# EAGLE design dani_pcb (EAGLE 9.3.2)
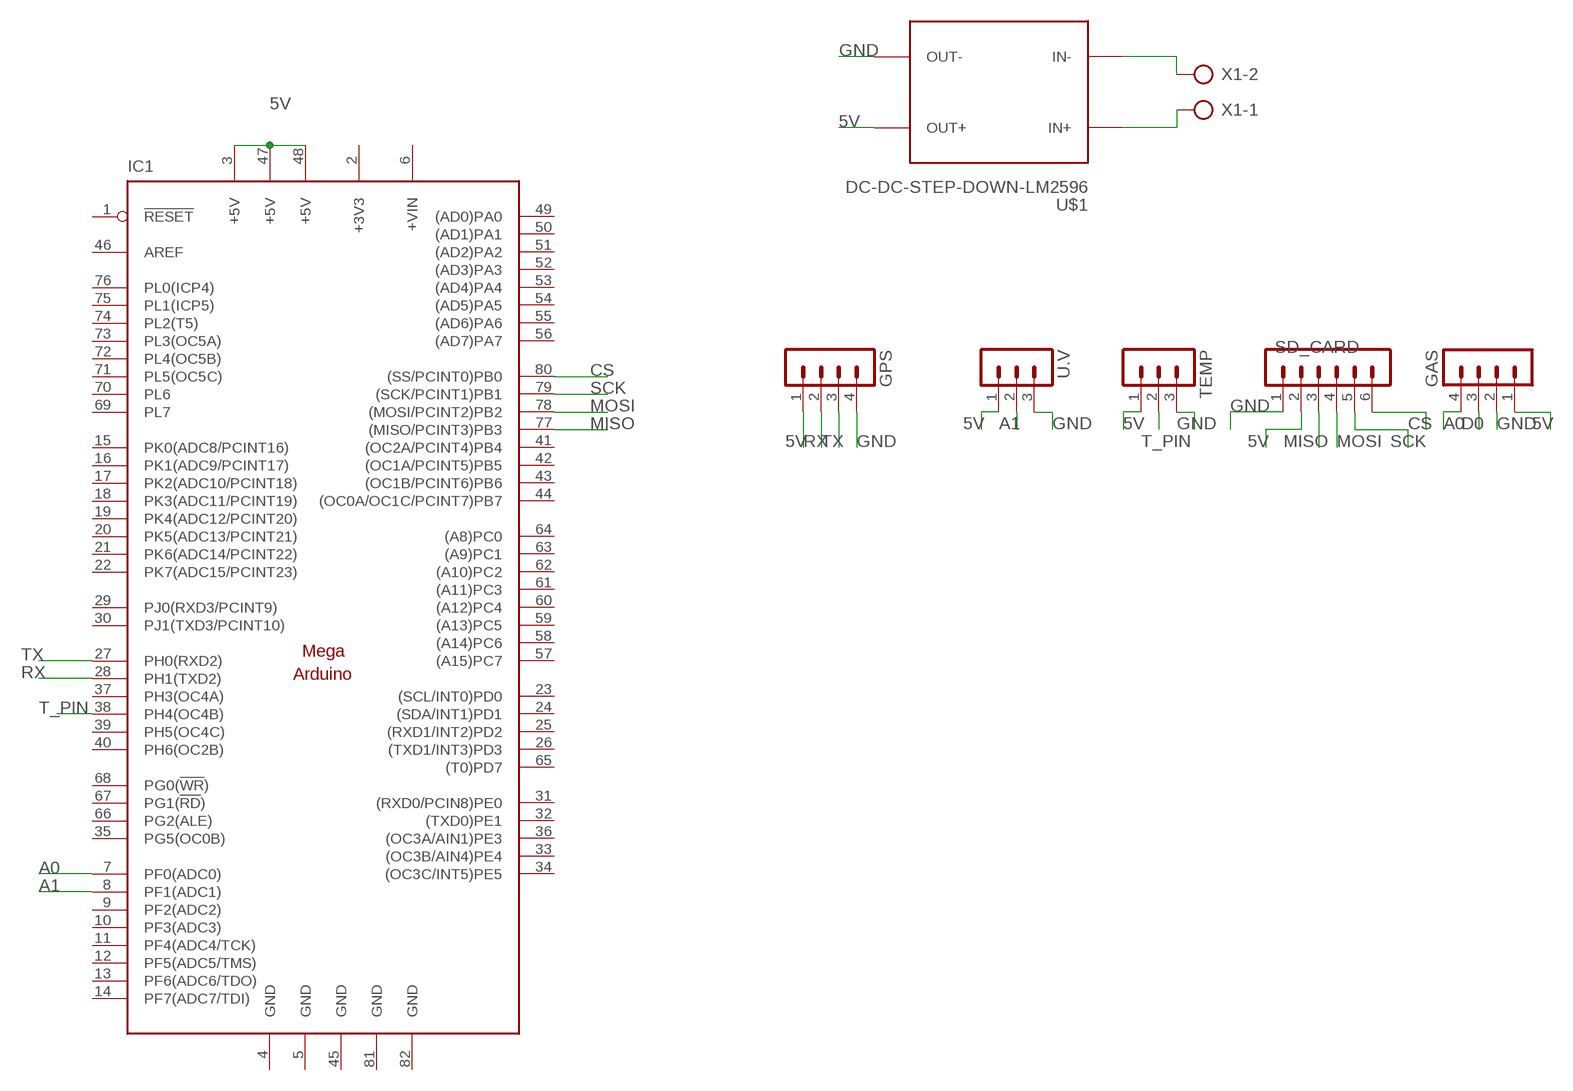
[diagram p0: schematic, sheet 1]

## Parts
GAS  MA04-1  [MA04-1]
GPS  MA04-1  [MA04-1]
IC1  MEGAARDUINO_1  [MEGA_ARDUINO]
SD_CARD  MA06-1  [MA06-1]
TEMP  MA03-1  [MA03-1]
U$1  DC-DC-STEP-DOWN-LM2596  [DC-DC-STEP-DOWN-LM2596]
U.V  MA03-1  [MA03-1]
X1  AK500/2-H  [AK500/2-H]

## Nets
5V: GAS.1 GPS.1 IC1.3(+5V) IC1.47(+5V) IC1.48(+5V) SD_CARD.2 TEMP.1 U$1.OUT+ U.V.1
A0: GAS.4 IC1.7(PF0(ADC0))
A1: IC1.8(PF1(ADC1)) U.V.2
CS: IC1.80((SS/PCINT0)PB0) SD_CARD.6
D0: GAS.3
GND: GAS.2 GPS.4 SD_CARD.1 TEMP.3 U$1.OUT- U.V.3
MISO: IC1.77((MISO/PCINT3)PB3) SD_CARD.3
MOSI: IC1.78((MOSI/PCINT2)PB2) SD_CARD.4
N$1: U$1.IN- X1.2
N$2: U$1.IN+ X1.1
RX: GPS.2 IC1.28(PH1(TXD2))
SCK: IC1.79((SCK/PCINT1)PB1) SD_CARD.5
T_PIN: IC1.38(PH4(OC4B)) TEMP.2
TX: GPS.3 IC1.27(PH0(RXD2))
Unconnected: IC1.1(!RESET) IC1.9(PF2(ADC2)) IC1.10(PF3(ADC3)) IC1.11(PF4(ADC4/TCK)) IC1.12(PF5(ADC5/TMS)) IC1.13(PF6(ADC6/TDO)) IC1.14(PF7(ADC7/TDI)) IC1.15(PK0(ADC8/PCINT16)) IC1.16(PK1(ADC9/PCINT17)) IC1.17(PK2(ADC10/PCINT18)) IC1.18(PK3(ADC11/PCINT19)) IC1.19(PK4(ADC12/PCINT20)) IC1.20(PK5(ADC13/PCINT21)) IC1.21(PK6(ADC14/PCINT22)) IC1.22(PK7(ADC15/PCINT23)) IC1.23((SCL/INT0)PD0) IC1.24((SDA/INT1)PD1) IC1.25((RXD1/INT2)PD2) IC1.26((TXD1/INT3)PD3) IC1.29(PJ0(RXD3/PCINT9)) IC1.30(PJ1(TXD3/PCINT10)) IC1.31((RXD0/PCIN8)PE0) IC1.32((TXD0)PE1) IC1.33((OC3B/AIN4)PE4) IC1.34((OC3C/INT5)PE5) IC1.35(PG5(OC0B)) IC1.36((OC3A/AIN1)PE3) IC1.37(PH3(OC4A)) IC1.39(PH5(OC4C)) IC1.40(PH6(OC2B)) IC1.41((OC2A/PCINT4)PB4) IC1.42((OC1A/PCINT5)PB5) IC1.43((OC1B/PCINT6)PB6) IC1.44((OC0A/OC1C/PCINT7)PB7) IC1.46(AREF) IC1.49((AD0)PA0) IC1.50((AD1)PA1) IC1.51((AD2)PA2) IC1.52((AD3)PA3) IC1.53((AD4)PA4) IC1.54((AD5)PA5) IC1.55((AD6)PA6) IC1.56((AD7)PA7) IC1.57((A15)PC7) IC1.58((A14)PC6) IC1.59((A13)PC5) IC1.60((A12)PC4) IC1.61((A11)PC3) IC1.62((A10)PC2) IC1.63((A9)PC1) IC1.64((A8)PC0) IC1.65((T0)PD7) IC1.66(PG2(ALE)) IC1.67(PG1(!RD!)) IC1.68(PG0(!WR!)) IC1.69(PL7) IC1.70(PL6) IC1.71(PL5(OC5C)) IC1.72(PL4(OC5B)) IC1.73(PL3(OC5A)) IC1.74(PL2(T5)) IC1.75(PL1(ICP5)) IC1.76(PL0(ICP4))

## Power pins joined to a net without a drawn wire
+3V3: IC1.2(+3V3)
+VIN: IC1.6(+VIN)
GND: IC1.4(GND) IC1.5(GND) IC1.45(GND) IC1.81(GND) IC1.82(GND)

## Library data of the parts
GAS GPS = con-lstb:MA04-1: PIN HEADER; OC_FARNELL: unknown; OC_NEWARK: unknown
IC1 = arduino:MEGAARDUINO_1: The Arduino Mega is a microcontroller board based on the ATmega1280. - 54 digital input/output pins (of which 14 can be used as PWM outputs) - 16 analog inputs - 4 UARTs (hardware serial ports) - 16 MHz crystal oscillator - USB connection - power jack - ICSP header - reset button It contains everything needed to support the microcontroller; simply connect it to a computer with a USB cable or power it with a AC-to-DC adapter or battery to get started. The Mega is compatible with most shields designed for the Arduino Duemilanove or Diecimila. http://arduino.cc/en/Main/ArduinoBoardMega
SD_CARD = con-lstb:MA06-1: PIN HEADER; OC_FARNELL: unknown; OC_NEWARK: unknown
TEMP U.V = con-lstb:MA03-1: PIN HEADER; OC_FARNELL: unknown; OC_NEWARK: unknown
U$1 = diy_modules:DC-DC-STEP-DOWN-LM2596: DC/DC Step-Down Regulator based on LM2596-ADJ chip LM2596 datasheet available here: http://www.ti.com/lit/ds/symlink/lm2596.pdf Click here to find device on ebay.com <http://www.ebay.com/sch/lm2596+power+regulator>
X1 = con-ptr500:AK500/2-H: CONNECTOR Aug. 2004 / PTR Meßtechnik: Die Bezeichnung der Serie AK505 wurde geändert. Es handelt sich hierbei um AK500 in horizontaler Ausführung.; OC_FARNELL: unknown; OC_NEWARK: unknown

## Board
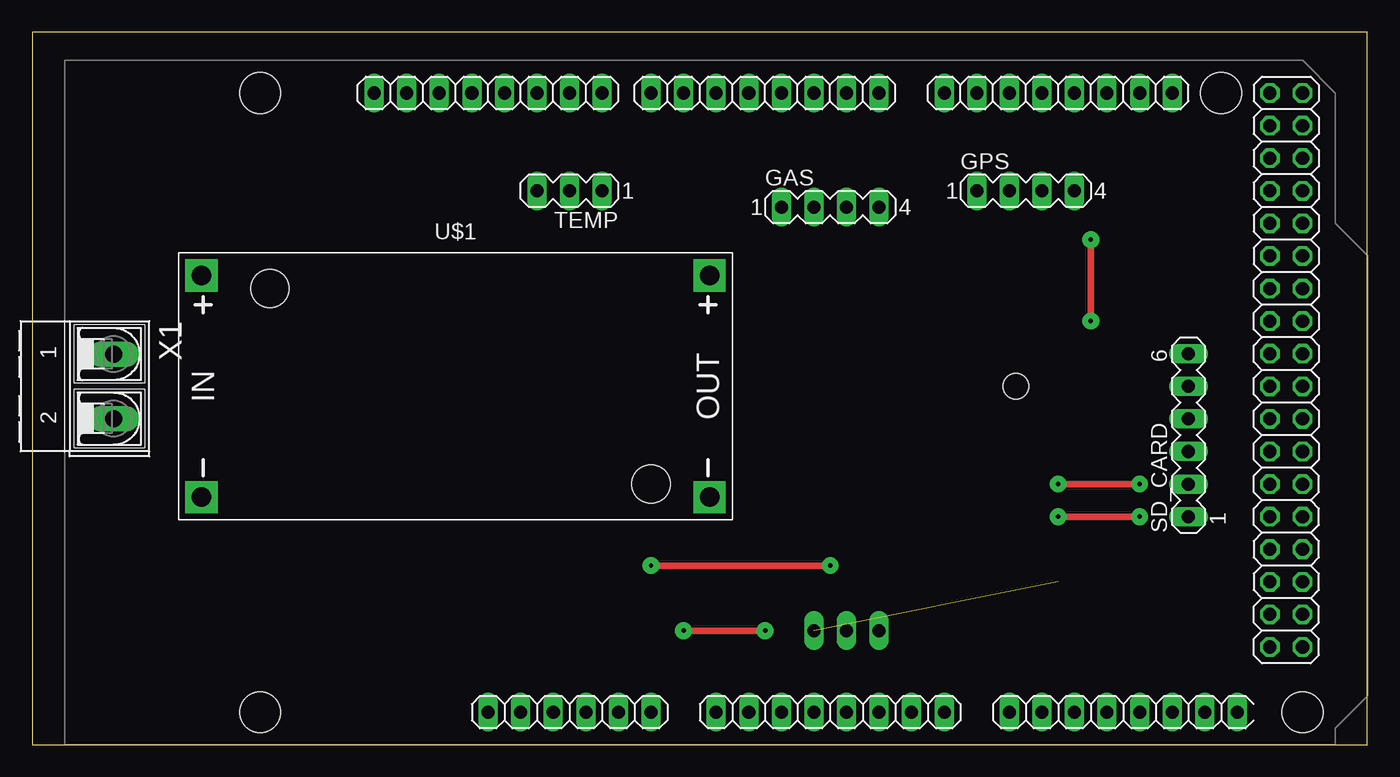
[diagram p1: board, top side]
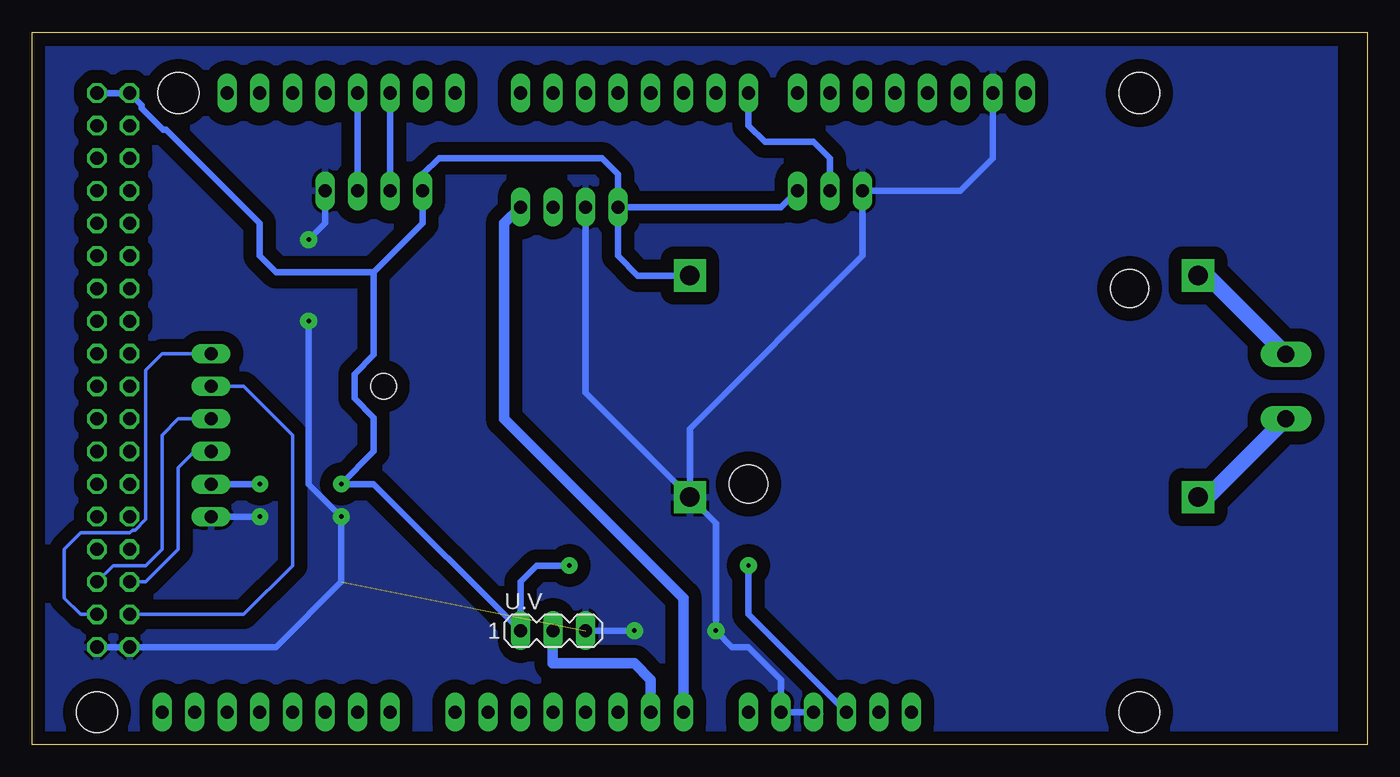
[diagram p2: board, bottom side, seen from below]

Size 104.12 x 55.55 mm. Coordinates in mm from the lower left corner, seen from the top.
Outline: 0,0 104.12,0 104.12,55.55 0,55.55 0,0
Copper layers (1*16): Top 0.035mm / dielectric 1.5mm / Bottom 0.035mm
Design rules "default *": minimum track width 6mil, minimum drill 0.35mm, track to track 40mil, track to pad 40mil, pad to pad 40mil, via to via 40mil, smd to smd 40mil, copper to edge 40mil, drill to drill 6mil, minimum pad ring 10mil, minimum via ring 8mil, stop-mask expansion 4mil, vias tented up to drill 0mil, thermal gap 10mil

### Footprints (pad centres in the part's own frame; a part is rotated, then mirrored left to right if it is on the bottom)
MA04-1 = drill 1.016 long: 1 -3.81,0; 2 -1.27,0; 3 1.27,0; 4 3.81,0
MEGA_ARDUINO = drill 1.016 long: 1 33.02,2.54; 2 35.56,2.54; 3 38.1,2.54; 4 40.64,2.54; 5 43.18,2.54; 6 45.72,2.54; 7 50.8,2.54; 8 53.34,2.54; 9 55.88,2.54; 10 58.42,2.54; 11 60.96,2.54; 12 63.5,2.54; 13 66.04,2.54; 14 68.58,2.54; 15 73.66,2.54; 16 76.2,2.54; 17 78.74,2.54; 18 81.28,2.54; 19 83.82,2.54; 20 86.36,2.54; 21 88.9,2.54; 22 91.44,2.54; 23 86.36,50.8; 24 83.82,50.8; 25 81.28,50.8; 26 78.74,50.8; 27 76.2,50.8; 28 73.66,50.8; 29 71.12,50.8; 30 68.58,50.8; 31 63.5,50.8; 32 60.96,50.8; 33 58.42,50.8; 34 55.88,50.8; 35 53.34,50.8; 36 50.8,50.8; 37 48.26,50.8; 38 45.72,50.8; 39 41.91,50.8; 40 39.37,50.8; 41 36.83,50.8; 42 34.29,50.8; 43 31.75,50.8; 44 29.21,50.8; 45 26.67,50.8; 46 24.13,50.8 | drill 1.016 octagon: 47 93.98,50.8; 48 96.52,50.8; 49 93.98,48.26; 50 96.52,48.26; 51 93.98,45.72; 52 96.52,45.72; 53 93.98,43.18; 54 96.52,43.18; 55 93.98,40.64; 56 96.52,40.64; 57 93.98,38.1; 58 96.52,38.1; 59 93.98,35.56; 60 96.52,35.56; 61 93.98,33.02; 62 96.52,33.02; 63 93.98,30.48; 64 96.52,30.48; 65 93.98,27.94; 66 96.52,27.94; 67 93.98,25.4; 68 96.52,25.4; 69 93.98,22.86; 70 96.52,22.86; 71 93.98,20.32; 72 96.52,20.32; 73 93.98,17.78; 74 96.52,17.78; 75 93.98,15.24; 76 96.52,15.24; 77 93.98,12.7; 78 96.52,12.7; 79 93.98,10.16; 80 96.52,10.16; 81 93.98,7.62; 82 96.52,7.62 | hole 3.2: 15.24,50.8; 15.24,2.54; 90.17,50.8; 96.52,2.54 | hole 2: 74.168,27.94
MA06-1 = drill 1.016 long: 1 -6.35,0; 2 -3.81,0; 3 -1.27,0; 4 1.27,0; 5 3.81,0; 6 6.35,0
MA03-1 = drill 1.016 long: 1 -2.54,0; 2 0,0; 3 2.54,0
DC-DC-STEP-DOWN-LM2596 = drill 1.5 pad 2.5 square: IN+ -19.812,8.636; IN- -19.812,-8.636; OUT+ 19.812,8.636; OUT- 19.812,-8.636 | hole 3: -14.478,7.62; 15.24,-7.62
AK500/2-H = drill 1.321 long: 1 -2.515,0; 2 2.515,0

### Placement (x,y rotation side)
GAS  62.23,41.91 0 top
GPS  77.47,43.18 0 top
IC1  2.54,0 0 top
SD_CARD  90.17,24.13 90 top
TEMP  41.91,43.18 180 top
U$1  33.02,27.94 0 top
U.V  63.5,8.89 0 bottom
X1  6.35,27.94 270 top

### Tracks (layer width: path | path; a pad name or v marks a point on that pad's centre or on a via)
5V  (via drill 0.35 pad 1.3)
  Top 0.508: v80.01,20.32 v86.36,20.32 | v48.26,13.97 v62.23,13.97
  Bottom 0.508: GAS.1 58.42,38.1 56.9,36.58 U$1.OUT+ | TEMP.1 45.72,41.91 GAS.1 | GAS.1 58.42,44.45 59.69,45.72 72.39,45.72 73.66,44.45 GPS.1 73.66,40.64 77.47,36.83 | IC1.48 IC1.47 95.58,49.86 95.58,49.61 93.9,47.93 93.65,47.93 86.36,40.64 86.36,38.1 85.09,36.83 77.47,36.83 | SD_CARD.2 v86.36,20.32 | IC1.3 48.26,10.16 v48.26,13.97 | v62.23,13.97 64.77,13.97 66.04,12.7 U.V.1 77.47,20.32 v80.01,20.32 77.47,22.86 77.47,25.49 78.98,27 78.98,28.88 77.47,30.39 77.47,36.83
A0
  Bottom 0.813: GAS.4 67.31,40.64 67.31,25.4 53.34,11.43 IC1.7
A1
  Bottom 0.813: U.V.2 63.55,8.84 63.55,6.35 57.15,6.35 55.88,5.08 IC1.8
CS
  Bottom 0.254: SD_CARD.6 93.98,30.48 95.25,29.21 95.25,17.58 96.09,16.74 96.29,16.74 96.52,16.51 100.33,16.51 101.6,15.24 101.6,11.43 100.33,10.16 IC1.80
GND  (via drill 0.35 pad 1.3)  (1 unrouted)
  Top 0.508: v86.36,17.78 v80.01,17.78 | v82.55,33.02 v82.55,39.37 | v57.15,8.89 v50.8,8.89
  Bottom 0.508: IC1.45 29.21,45.72 31.75,43.18 TEMP.3 39.37,38.1 52.83,24.64 U$1.OUT- | U$1.OUT- 52.96,19.43 60.96,27.43 GAS.2 | IC1.4 IC1.5 45.72,5.08 48.26,7.62 49.53,7.62 v50.8,8.89 50.8,17.27 U$1.OUT- | IC1.82 IC1.81 85.09,7.62 80.01,12.7 v80.01,17.78 82.55,20.32 v82.55,33.02 | SD_CARD.1 v86.36,17.78 | v82.55,39.37 81.28,40.64 GPS.4 | U.V.3 v57.15,8.89
  pour Bottom: 2.54,0 2.54,54.61 104.14,54.61 104.14,0
MISO
  Bottom 0.254: IC1.77 95.25,12.7 92.71,15.24 92.71,21.59 91.44,22.86 SD_CARD.3
MOSI
  Bottom 0.254: SD_CARD.4 92.71,25.4 93.98,24.13 93.98,15.24 95.25,13.97 97.79,13.97 IC1.78
N$1
  Bottom 1.27: X1.2 12.47,19.3 U$1.IN-
N$2
  Bottom 1.27: X1.1 12.47,36.58 U$1.IN+
RX
  Bottom 0.508: IC1.28 GPS.2
SCK
  Bottom 0.254: SD_CARD.5 87.63,27.94 83.82,24.13 83.82,13.97 87.63,10.16 IC1.79
T_PIN
  Bottom 0.508: TEMP.2 41.91,45.72 43.18,46.99 46.99,46.99 48.26,48.26 IC1.38
TX
  Bottom 0.508: GPS.3 IC1.27